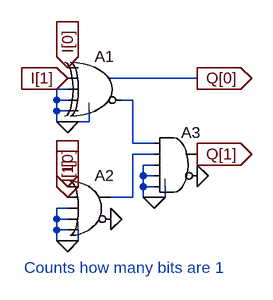
[diagram p0: schematic 1counter_2bit.asc]
1counter_2bit.asc, the LTspice schematic file:
Version 4
SHEET 1 880 680
WIRE 304 96 176 96
WIRE 112 112 96 112
WIRE 96 128 96 112
WIRE 112 128 96 128
WIRE 208 128 192 128
WIRE 96 144 96 128
WIRE 112 144 96 144
WIRE 96 160 96 144
WIRE 112 160 96 160
WIRE 144 160 144 144
WIRE 144 160 112 160
WIRE 208 192 208 128
WIRE 240 192 208 192
WIRE 240 208 208 208
WIRE 240 224 224 224
WIRE 224 240 224 224
WIRE 240 240 224 240
WIRE 224 256 224 240
WIRE 240 256 224 256
WIRE 208 272 208 208
WIRE 208 272 176 272
WIRE 224 272 224 256
WIRE 240 272 224 272
WIRE 256 272 256 256
WIRE 256 272 240 272
WIRE 112 288 96 288
WIRE 96 304 96 288
WIRE 112 304 96 304
WIRE 96 320 96 304
WIRE 112 320 96 320
WIRE 96 336 96 320
WIRE 112 336 96 336
WIRE 128 336 128 320
WIRE 128 336 112 336
FLAG 112 160 0
FLAG 112 80 I[0]
IOPIN 112 80 In
FLAG 112 96 I[1]
IOPIN 112 96 In
FLAG 304 96 Q[0]
IOPIN 304 96 Out
FLAG 112 336 0
FLAG 112 256 I[0]
IOPIN 112 256 In
FLAG 112 272 I[1]
IOPIN 112 272 In
FLAG 240 272 0
FLAG 304 208 Q[1]
IOPIN 304 208 Out
FLAG 304 240 0
FLAG 176 304 0
SYMBOL Digital\\xor 160 48 R0
SYMATTR InstName A1
SYMBOL Digital\\or 144 224 R0
SYMATTR InstName A2
SYMBOL Digital\\and 272 160 R0
SYMATTR InstName A3
TEXT 48 376 Left 2 ;Counts how many bits are 1

The netlist it stands for:
* 1counter_2bit.asc
A1 I[0] I[1] 0 0 0 N001 Q[0] 0 XOR
A2 I[0] I[1] 0 0 0 0 N002 0 OR
A3 N001 N002 0 0 0 0 Q[1] 0 AND
* Counts how many bits are 1
.backanno
.end